# Altium schematic sheet K60P144.SchDoc
size A2
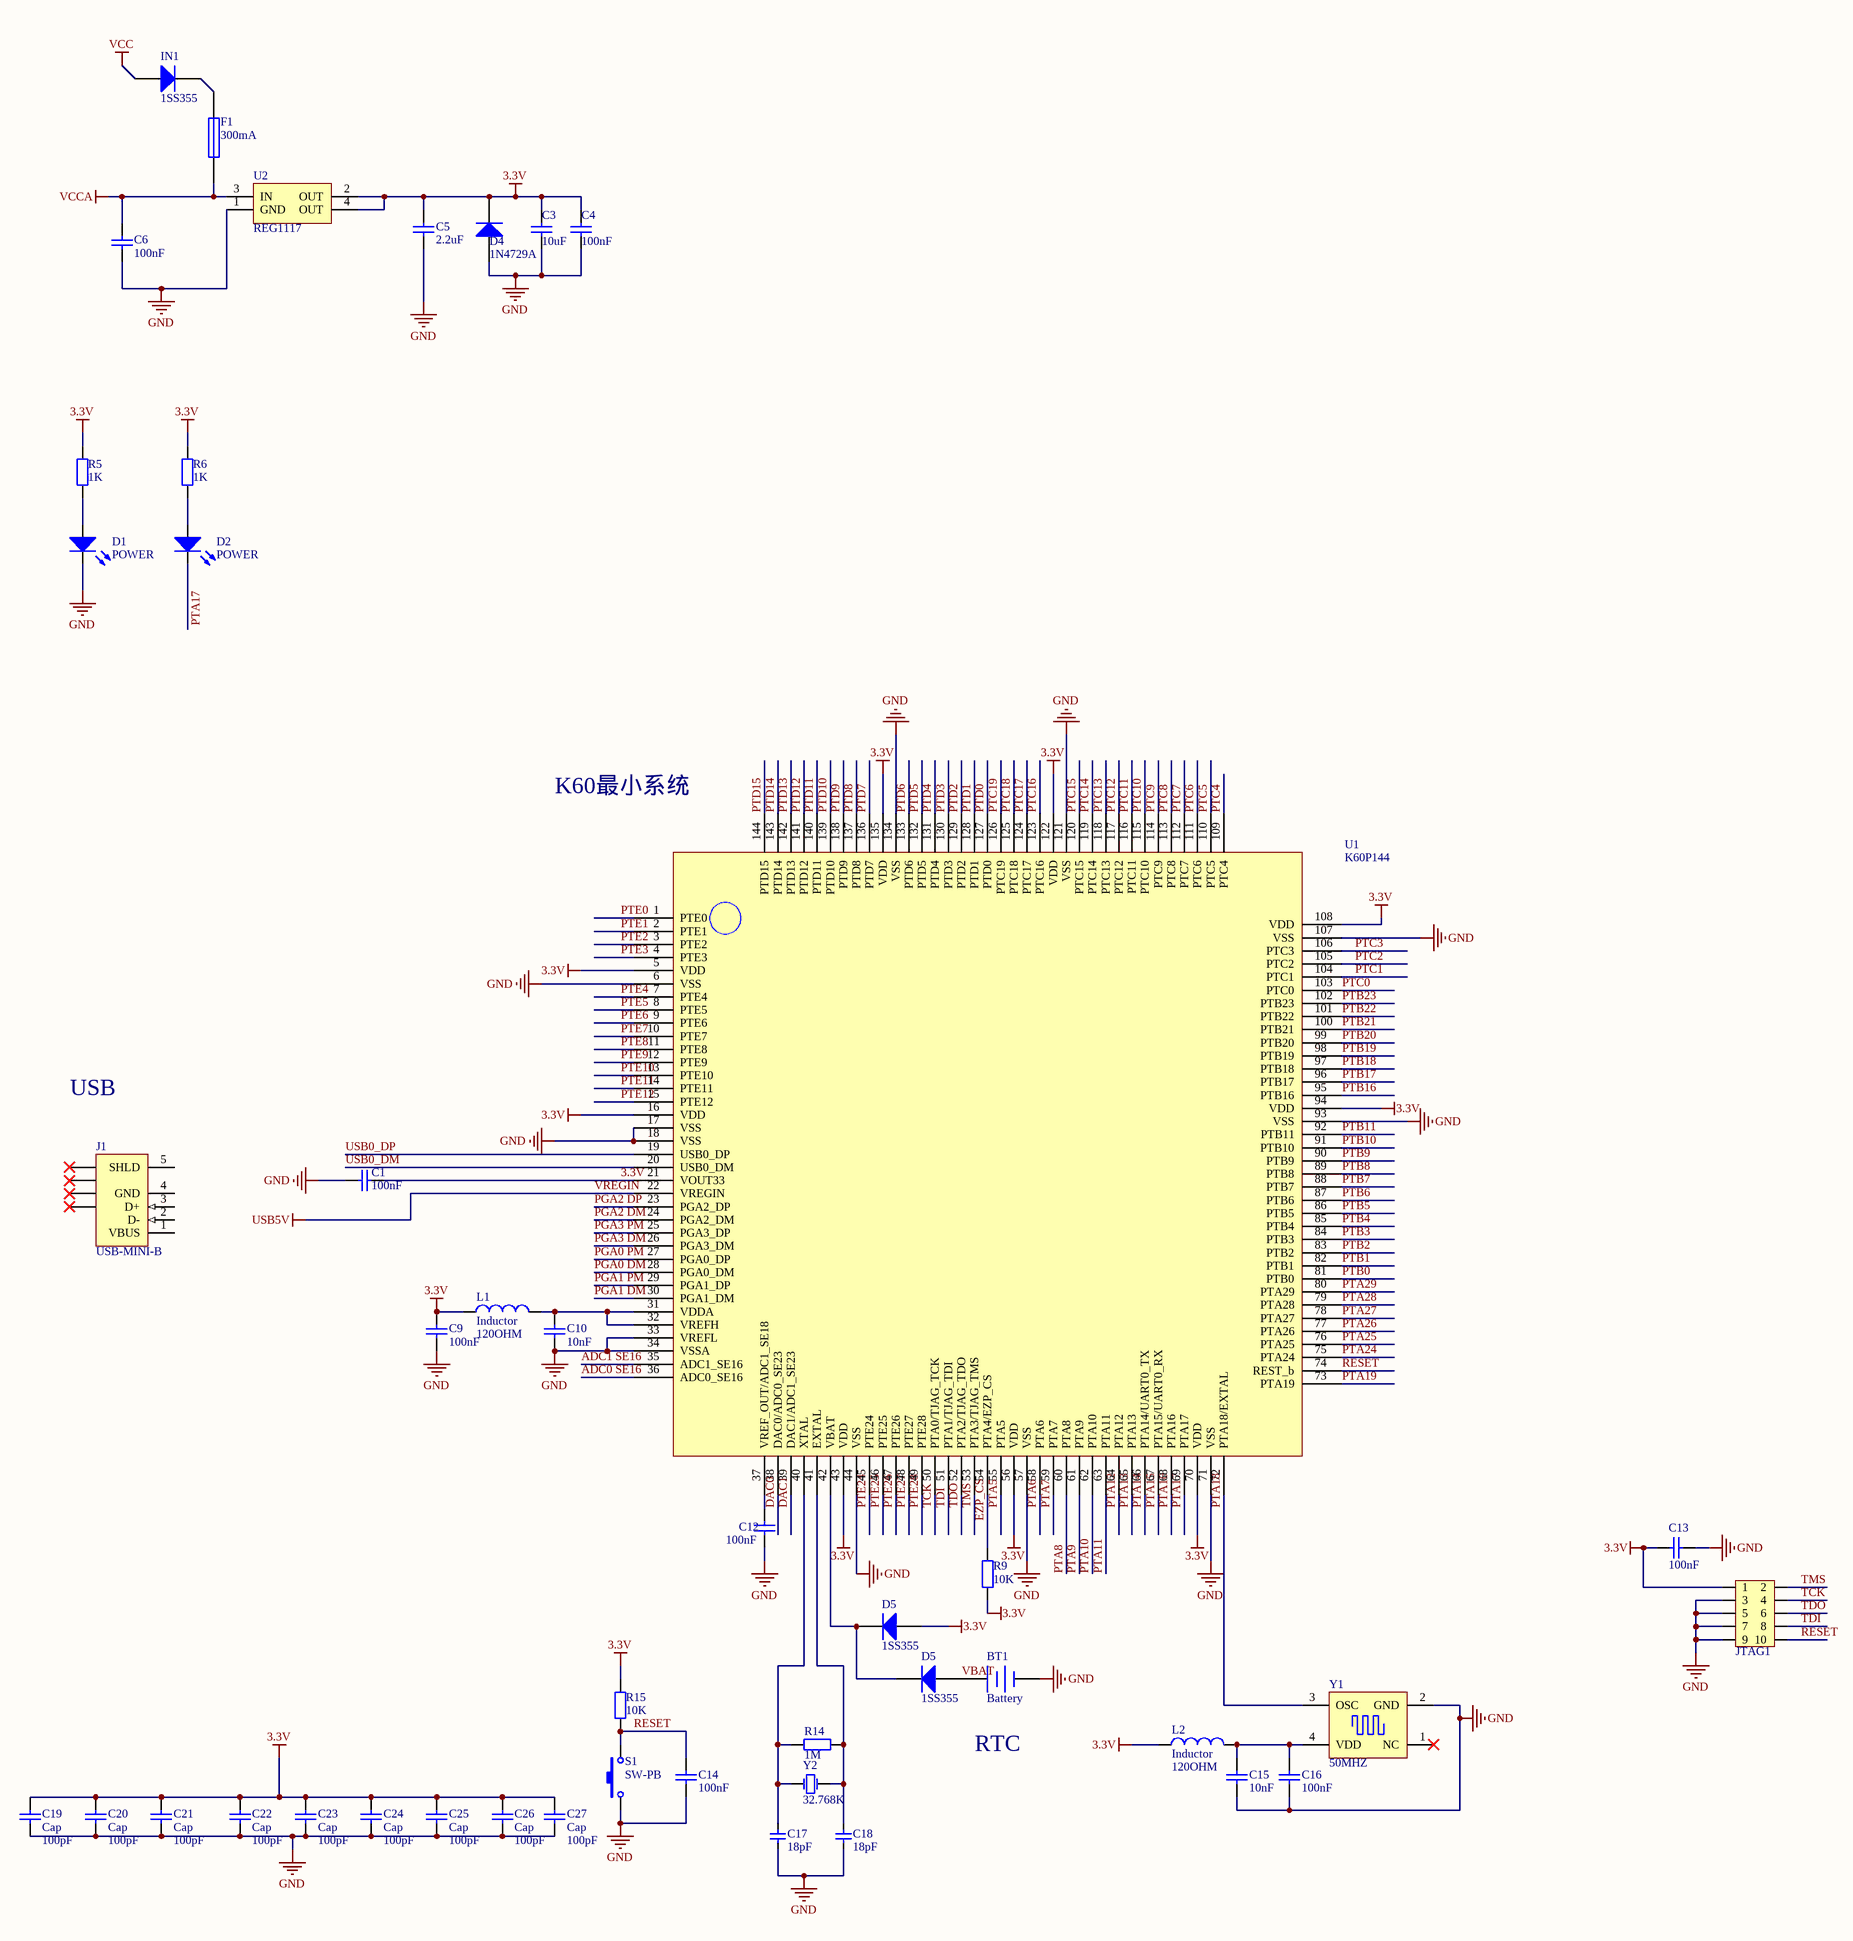
[diagram p0: K60P144.SchDoc]

## Parts
(Parts that share a designator on the sheet are numbered #1, #2 ... from top to bottom, then left to right.)
BT1  Battery  [3v battery]
C1  100nF  [0805]
C3  10uF  [0805]
C4  100nF  [0805]
C5  2.2uF  [0805]
C6  100nF  [0805]
C9  100nF  [0805]
C10  10nF  [0805]
C12  100nF  [0805]
C13  100nF  [0805]
C14  100nF  [0805]
C15  10nF  [0805]
C16  100nF  [0805]
C17  18pF  [0805]
C18  18pF  [0805]
C19  Cap  value 100pF  [C2012]
C20  Cap  value 100pF  [C2012]
C21  Cap  value 100pF  [C2012]
C22  Cap  value 100pF  [C2012]
C23  Cap  value 100pF  [C2012]
C24  Cap  value 100pF  [C2012]
C25  Cap  value 100pF  [C2012]
C26  Cap  value 100pF  [C2012]
C27  Cap  value 100pF  [C2012]
D1  POWER  [0805]
D2  POWER  [0805]
D4  1N4729A  [hole-chip diode]
D5#1  1SS355  [0805]
D5#2  1SS355  [0805]
F1  300mA  [0805(2012)]
IN1  1SS355  [1206(2)]
J1  USB-MINI-B  [USB-MINI-B]
JTAG1  Header 5X2  [IDC5X2]  (value not drawn)
L1  Inductor  value 120OHM  [0805]
L2  Inductor  value 120OHM  [0805]
R5  1K  [0805]
R6  1K  [0805]
R9  10K  [0805]
R14  1M  [0805]
R15  10K  [0805]
S1  SW-PB  [SMT_Button]
U1  K60P144  [LQFP-144]
U2  REG1117  [SOT223]
Y1  50MHZ  [贴片有源晶体]
Y2  32.768K  [HDR1X2]

## Nets
3.3V: C1.2 C3.2 C4.2 C5.2 C9.2 C13.1 C19.2 C20.2 C21.2 C22.2 C23.2 C24.2 C25.2 C26.2 C27.2 D4.2(K) D5#1.1(A) JTAG1.1 L1.1 L2.1 R5.2 R6.2 R9.1 R15.2 U1.5(VDD) U1.16(VDD) U1.21(VOUT33) U1.43(VDD) U1.56(VDD) U1.70(VDD) U1.94(VDD) U1.108(VDD) U1.122(VDD) U1.135(VDD) U2.2(OUT) U2.4(OUT)
GND: BT1.2(-) C1.1 C3.1 C4.1 C5.1 C6.1 C9.1 C10.1 C12.1 C13.2 C14.1 C15.1 C16.1 C17.1 C18.1 C19.1 C20.1 C21.1 C22.1 C23.1 C24.1 C25.1 C26.1 C27.1 D1.2 D4.1(A) JTAG1.3 JTAG1.5 JTAG1.7 JTAG1.9 S1.1 U1.6(VSS) U1.17(VSS) U1.18(VSS) U1.33(VREFL) U1.34(VSSA) U1.44(VSS) U1.57(VSS) U1.71(VSS) U1.93(VSS) U1.107(VSS) U1.121(VSS) U1.134(VSS) U2.1(GND) Y1.2(GND)
VCC: IN1.1(A)
VCCA: C6.2 F1.1 U2.3(IN)
VREGIN: U1.22(VREGIN)  [also labelled USB5V]
ADC0 SE16: U1.36(ADC0_SE16)
ADC1 SE16: U1.35(ADC1_SE16)
DAC0: U1.38(DAC0/ADC0_SE23)
DAC1: U1.39(DAC1/ADC1_SE23)
EZP_CS: R9.2 U1.54(PTA4/EZP_CS)
PGA0 DM: U1.28(PGA0_DM)
PGA0 PM: U1.27(PGA0_DP)
PGA1 DM: U1.30(PGA1_DM)
PGA1 PM: U1.29(PGA1_DP)
PGA2 DM: U1.24(PGA2_DM)
PGA2 DP: U1.23(PGA2_DP)
PGA3 DM: U1.26(PGA3_DM)
PGA3 PM: U1.25(PGA3_DP)
PTA5: U1.55(PTA5)
PTA6: U1.58(PTA6)
PTA7: U1.59(PTA7)
PTA8: U1.60(PTA8)
PTA9: U1.61(PTA9)
PTA10: U1.62(PTA10)
PTA11: U1.63(PTA11)
PTA12: U1.64(PTA12)
PTA13: U1.65(PTA13)
PTA14: U1.66(PTA14/UART0_TX)
PTA15: U1.67(PTA15/UART0_RX)
PTA16: U1.68(PTA16)
PTA17: D2.2 U1.69(PTA17)
PTA18: U1.72(PTA18/EXTAL) Y1.3(OSC)
PTA19: U1.73(PTA19)
PTA24: U1.75(PTA24)
PTA25: U1.76(PTA25)
PTA26: U1.77(PTA26)
PTA27: U1.78(PTA27)
PTA28: U1.79(PTA28)
PTA29: U1.80(PTA29)
PTB0: U1.81(PTB0)
PTB1: U1.82(PTB1)
PTB2: U1.83(PTB2)
PTB3: U1.84(PTB3)
PTB4: U1.85(PTB4)
PTB5: U1.86(PTB5)
PTB6: U1.87(PTB6)
PTB7: U1.88(PTB7)
PTB8: U1.89(PTB8)
PTB9: U1.90(PTB9)
PTB10: U1.91(PTB10)
PTB11: U1.92(PTB11)
PTB16: U1.95(PTB16)
PTB17: U1.96(PTB17)
PTB18: U1.97(PTB18)
PTB19: U1.98(PTB19)
PTB20: U1.99(PTB20)
PTB21: U1.100(PTB21)
PTB22: U1.101(PTB22)
PTB23: U1.102(PTB23)
PTC0: U1.103(PTC0)
PTC1: U1.104(PTC1)
PTC2: U1.105(PTC2)
PTC3: U1.106(PTC3)
PTC4: U1.109(PTC4)
PTC5: U1.110(PTC5)
PTC6: U1.111(PTC6)
PTC7: U1.112(PTC7)
PTC8: U1.113(PTC8)
PTC9: U1.114(PTC9)
PTC10: U1.115(PTC10)
PTC11: U1.116(PTC11)
PTC12: U1.117(PTC12)
PTC13: U1.118(PTC13)
PTC14: U1.119(PTC14)
PTC15: U1.120(PTC15)
PTC16: U1.123(PTC16)
PTC17: U1.124(PTC17)
PTC18: U1.125(PTC18)
PTC19: U1.126(PTC19)
PTD0: U1.127(PTD0)
PTD1: U1.128(PTD1)
PTD2: U1.129(PTD2)
PTD3: U1.130(PTD3)
PTD4: U1.131(PTD4)
PTD5: U1.132(PTD5)
PTD6: U1.133(PTD6)
PTD7: U1.136(PTD7)
PTD8: U1.137(PTD8)
PTD9: U1.138(PTD9)
PTD10: U1.139(PTD10)
PTD11: U1.140(PTD11)
PTD12: U1.141(PTD12)
PTD13: U1.142(PTD13)
PTD14: U1.143(PTD14)
PTD15: U1.144(PTD15)
PTE0: U1.1(PTE0)
PTE1: U1.2(PTE1)
PTE2: U1.3(PTE2)
PTE3: U1.4(PTE3)
PTE4: U1.7(PTE4)
PTE5: U1.8(PTE5)
PTE6: U1.9(PTE6)
PTE7: U1.10(PTE7)
PTE8: U1.11(PTE8)
PTE9: U1.12(PTE9)
PTE10: U1.13(PTE10)
PTE11: U1.14(PTE11)
PTE12: U1.15(PTE12)
PTE24: U1.45(PTE24)
PTE25: U1.46(PTE25)
PTE26: U1.47(PTE26)
PTE27: U1.48(PTE27)
PTE28: U1.49(PTE28)
RESET: C14.2 JTAG1.10 R15.1 S1.2 U1.74(REST_b)
TCK: JTAG1.4 U1.50(PTA0/TJAG_TCK)
TDI: JTAG1.8 U1.51(PTA1/TJAG_TDI)
TDO: JTAG1.6 U1.52(PTA2/TJAG_TDO)
TMS: JTAG1.2 U1.53(PTA3/TJAG_TMS)
USB0_DM: U1.20(USB0_DM)
USB0_DP: U1.19(USB0_DP)
VBAT: BT1.1(+) D5#2.1(A)
NetC10_2: C10.2 L1.2 U1.31(VDDA) U1.32(VREFH)
NetC12_2: C12.2 U1.37(VREF_OUT/ADC1_SE18)
NetC15_2: C15.2 C16.2 L2.2 Y1.4(VDD)
NetC17_2: C17.2 R14.1 U1.40(XTAL) Y2.1(OSC1)
NetC18_2: C18.2 R14.2 U1.41(EXTAL) Y2.2(OSC2)
NetD1_1: D1.1 R5.1
NetD2_1: D2.1 R6.1
NetD5#1_2: D5#1.2(K) D5#2.2(K) U1.42(VBAT)
NetF1_2: F1.2 IN1.2(K)

Not connected (* = marked no-connect by the designer): J1 1(VBUS) 2(D-) 3(D+) 4(GND) 5(SHLD) 6(SHLD)* 7(SHLD)* 8(SHLD)* 9(SHLD)*; Y1 1(NC)*

## Notes on the sheet
- K60最小系统
- USB
- RTC

## Library data of the parts
BT1 = Battery: Multicell Battery; Published: 24-Mar-1999; LatestRevisionDate: 17-Jul-2002; LatestRevisionNote: Re-released for DXP Platform.; PackageReference: BAT-2; Publisher: Altium Limited
C1 C3-C6 C9 C10 C12-C16 = Cap: Capacitor
C17 C18 = 陶瓷电容: CAP
C19-C27 = Cap: 贴片电容; Published: 8-Jun-2000; LatestRevisionDate: 17-Jul-2002; LatestRevisionNote: Re-released for DXP Platform.; PackageReference: RAD-0.3; Publisher: Altium Limited
D1 D2 = LED: Typical INFRARED GaAs LED
D4 D5#1 D5#2 IN1 = Diode 1N4148: High Conductance Fast Diode; LatestRevisionDate: 17-Jul-2002; LatestRevisionNote: Re-released for DXP Platform.; DatasheetDocument: 1997; PackageReference: DO-35; Publisher: Altium Limited; Code_JEDEC: DO-204-AH; ComponentLink1Description: Manufacturer Link; ComponentLink2Description: Datasheet; ComponentLink2URL: http://www.fairchildsemi.com/ds/1N%2F1N4148.pdf
F1 = Fuse 1: Fuse; Published: 8-Jun-2000; LatestRevisionDate: 17-Jul-2002; LatestRevisionNote: Re-released for DXP Platform.; PackageReference: PIN-W2/E2.8; Publisher: Altium Limited
J1 = USB-MINI-B: USB 2.0, Right Angle, SMT, A Type, Receptacle, 5 Position, Black; ContactMaterial: Phosphor Bronze; ContactPlating: Gold (30) over Nickel; PCB_Layout: Complies with manufacturer's recommendation.; DrillSize: Corresponds to nominal value.; PanelGround: Without; Published: 15-Jul-2004; DatasheetDocument: 15-Nov-2002; PackageDocument: 15-Nov-2002; PackageReference: 440478; Publisher: Altium Limited; HousingMaterial: Thermoplastic; ComponentLink1Description: Manufacturer Link; ComponentLink1URL: http://www.tycoelectronics.com/; ComponentLink2Description: Packaging Specification; ComponentLink2URL: http://ecommas.tycoelectronics.com/commerce/DocumentDelivery/DDEController?Action=showdoc&DocId=Customer+Drawing%7F440478%7FB%7Fpdf%7FEnglish%7FC_440478_B.pdf
JTAG1 = Header 5X2: Header, 5-Pin, Dual row
L1 L2 = Inductor: Code_IEC: 1005; Published: 8-Jun-2000; LatestRevisionDate: 29-May-2009; LatestRevisionNote: IPC-7351 Footprint Added.; PackageReference: 0402-A; Publisher: Altium Limited; PackageDescription: Chip Inductor; Code_JEITA: 0402
R5 R6 R9 R14 R15 = Res: Resistor
S1 = SW-PB: Switch
U2 = REG1117: 800mA and 1A Low Dropout Positive Regulator 2.85V, 3.3V, 5V, and Adjustable; Published: 8-Jun-2000; LatestRevisionDate: 17-Jul-2002; LatestRevisionNote: Re-released for DXP Platform.; DatasheetVersion: Sep-1997; PackageVersion: revC; PackageReference: ZZ311; Publisher: Altium Limited; PackageDescription: SOT-223/SC-73; 4 Leads; Body 6.7 x 7.3 mm, inc. leads (LxW max); ComponentLink1Description: Manufacturer Link; ComponentLink1URL: http://www.ti.com/; ComponentLink2Description: Datasheet; ComponentLink2URL: http://www-s.ti.com/sc/ds/REG1117.pdf
Y1 = XTAL1
Y2 = XTAL: Crystal Oscillator